# EAGLE design Breakout (EAGLE 7.1.0)
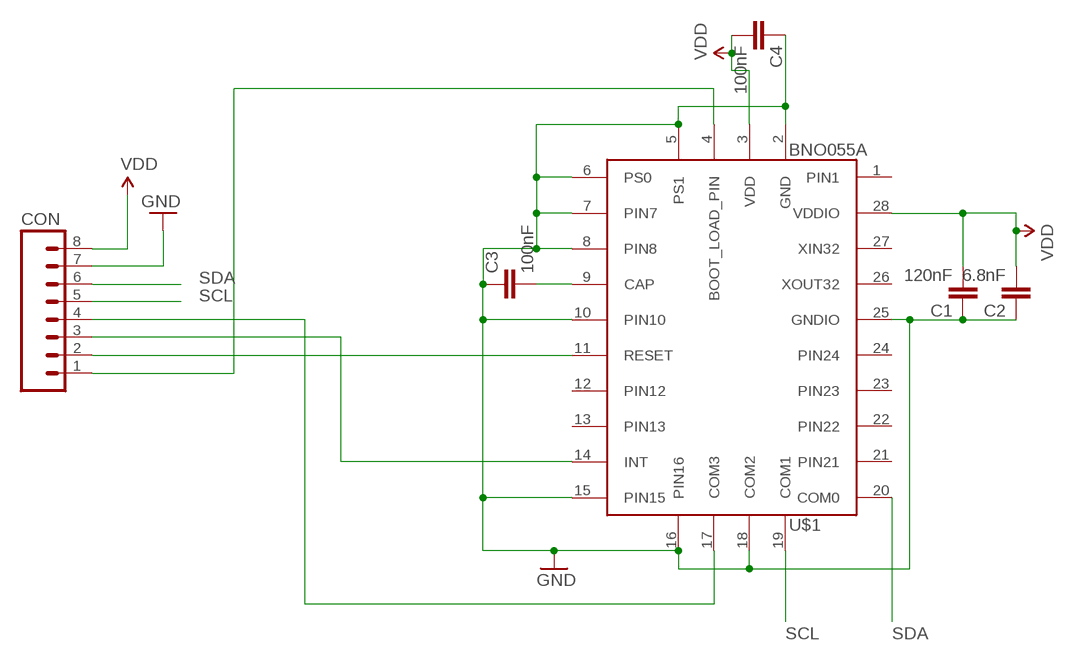
[diagram p0: schematic, sheet 1]

## Parts
C1  120nF  CAP1206  [1206]
C2  6.8nF  CAP1206  [1206]
C3  100nF  CAP1206  [1206]
C4  100nF  CAP1206  [1206]
CON  M08NO_SILK  [1X08_NO_SILK]
U$1  BNO055A  [BNO055]

## Nets
GND: C1.1 C2.1 C3.1 C4.1 CON.7 U$1.2(GND) U$1.5(PS1) U$1.6(PS0) U$1.7(PIN7) U$1.8(PIN8) U$1.10(PIN10) U$1.15(PIN15) U$1.16(PIN16) U$1.18(COM2) U$1.25(GNDIO)
N$1: CON.2 U$1.11(RESET)
N$2: C3.2 U$1.9(CAP)
N$6: CON.1 U$1.4(BOOT_LOAD_PIN)
N$7: CON.3 U$1.14(INT)
N$8: CON.4 U$1.17(COM3)
SCL: CON.5 U$1.19(COM1)
SDA: CON.6 U$1.20(COM0)
VDD: C1.2 C2.2 C4.2 CON.8 U$1.3(VDD) U$1.28(VDDIO)
Unconnected: U$1.1(PIN1) U$1.12(PIN12) U$1.13(PIN13) U$1.21(PIN21) U$1.22(PIN22) U$1.23(PIN23) U$1.24(PIN24) U$1.26(XOUT32) U$1.27(XIN32)

## Library data of the parts
C1-C4 = SparkFun-Capacitors:CAP: Capacitor Standard 0603 ceramic capacitor, and 0.1" leaded capacitor.
CON = SparkFun-Connectors:M08: Header 8 Standard 8-pin 0.1" header. Use with straight break away headers (SKU : PRT-00116), right angle break away headers (PRT-00553), swiss pins (PRT-00743), machine pins (PRT-00117), and female headers (PRT-00115).
U$1 = BNO055:BNO055

## Board
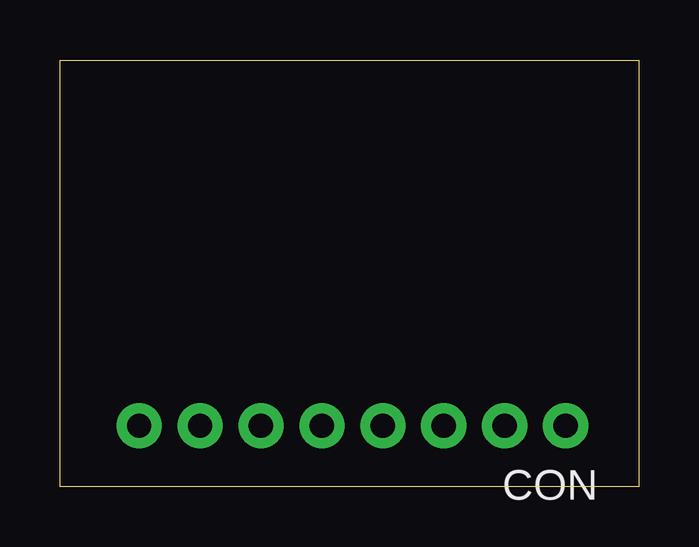
[diagram p1: board, top side]
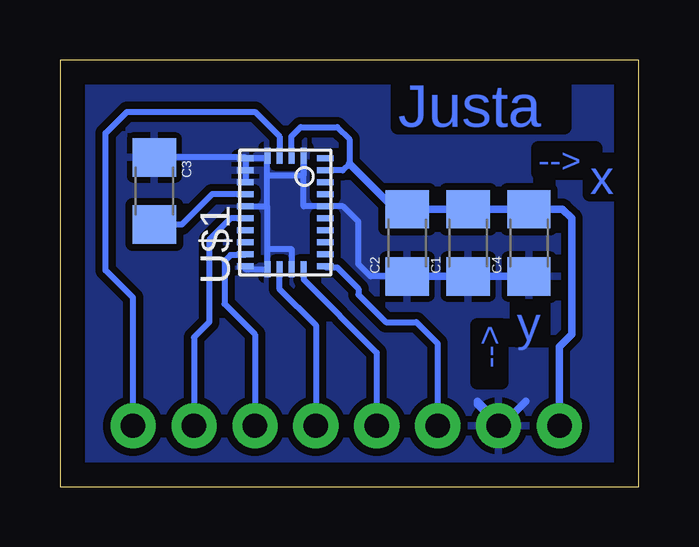
[diagram p2: board, bottom side, seen from below]

Size 24.13 x 17.78 mm. Coordinates in mm from the lower left corner, seen from the top.
Outline: 0,0 0,17.78 24.13,17.78 24.13,0 0,0
Copper layers (1*16): Top 0.035mm / dielectric 1.5mm / Bottom 0.035mm
Design rules "default *": minimum track width 10mil, minimum drill 24mil, track to track 0.3mm, track to pad 0.3mm, pad to pad 0.3mm, via to via 0.3mm, smd to smd 0.3mm, copper to edge 40mil, drill to drill 8mil, minimum pad ring 10mil, minimum via ring 8mil, stop-mask expansion 4mil, vias tented up to drill 0mil, thermal gap 10mil
Milling: 4 lines

### Footprints (pad centres in the part's own frame; a part is rotated, then mirrored left to right if it is on the bottom)
1206 = smd 1.6 x 1.8: 1 -1.4,0; 2 1.4,0
1X08_NO_SILK = drill 1.016 pad 1.88: 1 0,0; 2 2.54,0; 3 5.08,0; 4 7.62,0; 5 10.16,0; 6 12.7,0; 7 15.24,0; 8 17.78,0
BNO055 = smd 0.675 x 0.25: 1 1.663,2.25; 6 -1.665,2.25; 7 -1.665,1.75; 8 -1.665,1.25; 9 -1.665,0.75; 10 -1.665,0.25; 11 -1.665,-0.25; 12 -1.665,-0.75; 13 -1.665,-1.25; 14 -1.665,-1.75; 15 -1.665,-2.25; 20 1.663,-2.25; 21 1.663,-1.75; 22 1.663,-1.25; 23 1.663,-0.75; 24 1.663,-0.25; 25 1.663,0.25; 26 1.663,0.75; 27 1.663,1.25; 28 1.663,1.75 | smd 0.25 x 0.675: 2 0.75,2.362; 3 0.25,2.362; 4 -0.25,2.362; 5 -0.75,2.362; 16 -0.75,-2.362; 17 -0.25,-2.362; 18 0.25,-2.362; 19 0.75,-2.362

### Placement (x,y rotation side)
C1  7.11,10.16 90 bottom
C2  9.65,10.16 90 bottom
C3  20.19,12.32 270 bottom
C4  4.57,10.16 90 bottom
CON  21.08,2.54 180 top
U$1  14.73,11.43 0 bottom

### Tracks (layer width: path | path; a pad name or v marks a point on that pad's centre or on a via)
GND
  Bottom 0.254: C2.1 11.17,8.76 11.68,9.27 11.68,11.05 12.32,11.68 U$1.25 13.97,11.68 U$1.2 13.98,12.95 15.49,12.95 | 15.49,12.95 15.49,13.79 U$1.5 15.48,13.68 U$1.6 | U$1.6 U$1.7 U$1.8 | U$1.6 16.4,13.72 C3.1 | U$1.10 15.49,11.68 | 15.49,11.68 15.49,12.95 | U$1.15 16.4,9.07 U$1.16 | U$1.16 15.48,11.68 15.49,11.68 | U$1.16 15.48,10.03 15.49,10.03 15.49,9.91 14.48,9.91 U$1.18
  Bottom 0.305: C2.1 C1.1 C4.1 | CON.7 6.73,3.43 6.73,3.56 5.71,2.54 4.7,3.56
  pour Bottom: 0,17.78 24.13,17.78 24.13,0 0,0
N$1
  Bottom 0.254: U$1.11 17.02,11.18 17.91,10.29 17.91,6.86 18.54,6.22 CON.2
N$2
  Bottom 0.254: U$1.9 16.41,12.19 17.78,12.19 19.05,10.92 C3.2
N$3
  pour Bottom: 0,17.78 24.13,17.78 24.13,0 0,0
N$6
  Bottom 0.254: CON.1 21.08,7.87 22.23,9.02 22.23,14.73 21.34,15.62 16,15.62 14.98,14.6 U$1.4
N$7
  Bottom 0.254: U$1.14 16.43,9.65 17.02,9.65 17.27,9.4 17.27,7.62 16,6.35 CON.3
N$8
  Bottom 0.254: U$1.17 14.99,8.26 13.46,6.73 CON.4
SCL
  Bottom 0.254: U$1.19 13.97,9.06 13.97,8.64 10.92,5.59 CON.5
SDA
  Bottom 0.254: U$1.20 13.03,9.14 12.57,9.14 11.68,8.26 11.68,8 10.54,6.86 9.27,6.86 8.38,5.97 CON.6
VDD
  Bottom 0.254: U$1.3 14.48,14.6 14.1,14.99 12.57,14.99 12.06,14.48 12.06,13.46 12.35,13.18 U$1.28
  Bottom 0.305: 12.06,13.46 10.16,11.56 C2.2 C1.2 C4.2 3.17,11.56 2.79,11.18 2.79,6.35 3.3,5.84 CON.8

### Text on the board
Bottom: Justa | --> | x | --> | y